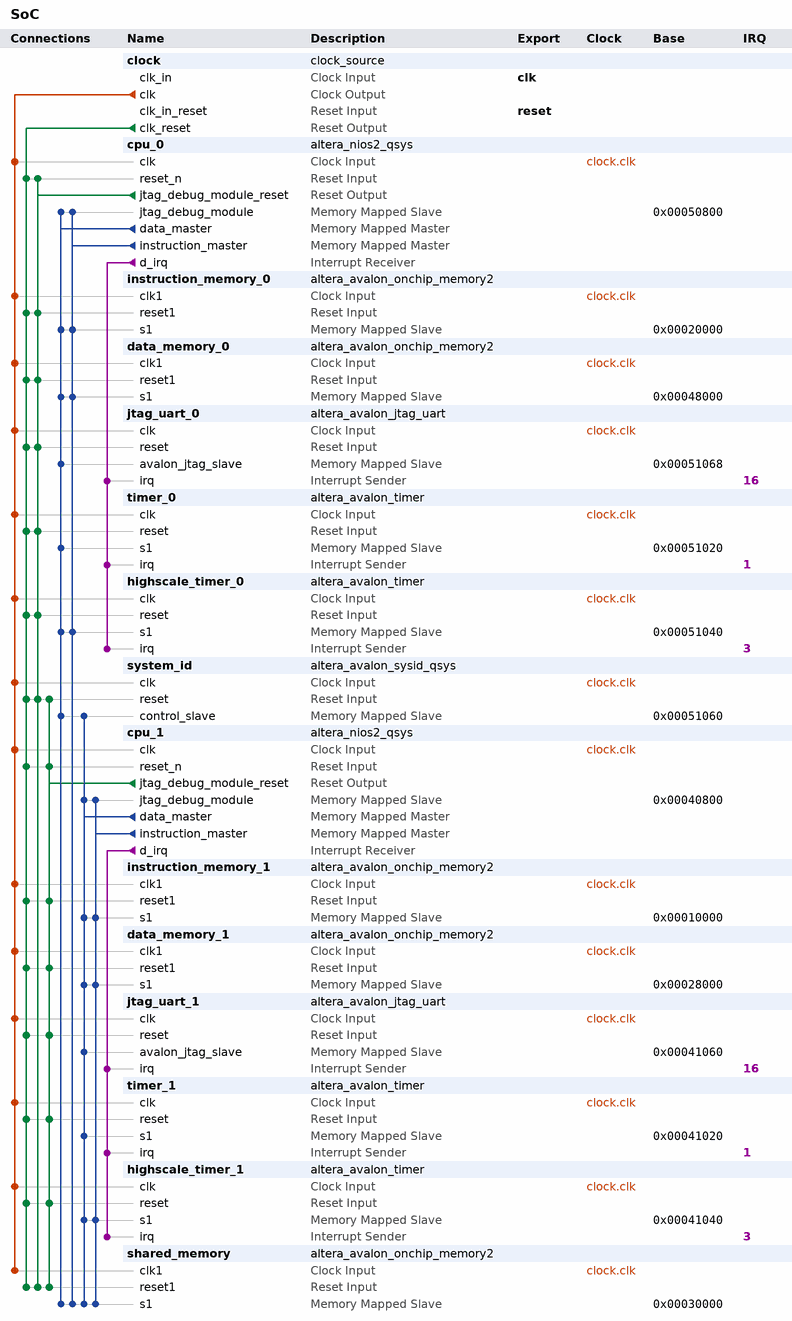
[diagram p0: system contents]
# Platform Designer (Qsys) system SoC, Cyclone IV E EP4CE115F29C7
# Parameters at their usual value, and those the tool derives, are not listed.
package require -exact qsys 13.1
create_system SoC
set_project_property DEVICE_FAMILY {Cyclone IV E}
set_project_property DEVICE EP4CE115F29C7

add_instance clock clock_source 13.1
set_instance_parameter_value clock clockFrequency 50000000

add_instance cpu_0 altera_nios2_qsys 13.1
set_instance_parameter_value cpu_0 resetSlave instruction_memory_0.s1
set_instance_parameter_value cpu_0 mmu_TLBMissExcSlave None
set_instance_parameter_value cpu_0 exceptionSlave instruction_memory_0.s1
set_instance_parameter_value cpu_0 breakSlave cpu_0.jtag_debug_module
set_instance_parameter_value cpu_0 muldiv_multiplierType NoneSmall
set_instance_parameter_value cpu_0 impl Small
set_instance_parameter_value cpu_0 icache_size 4096

add_instance instruction_memory_0 altera_avalon_onchip_memory2 13.1
set_instance_parameter_value instruction_memory_0 dataWidth 32
set_instance_parameter_value instruction_memory_0 dualPort false
set_instance_parameter_value instruction_memory_0 initMemContent true
set_instance_parameter_value instruction_memory_0 initializationFileName onchip_mem.hex
set_instance_parameter_value instruction_memory_0 memorySize 65536

add_instance data_memory_0 altera_avalon_onchip_memory2 13.1
set_instance_parameter_value data_memory_0 dataWidth 32
set_instance_parameter_value data_memory_0 dualPort false
set_instance_parameter_value data_memory_0 initMemContent true
set_instance_parameter_value data_memory_0 initializationFileName onchip_mem.hex
set_instance_parameter_value data_memory_0 memorySize 32768

add_instance jtag_uart_0 altera_avalon_jtag_uart 13.1
set_instance_parameter_value jtag_uart_0 simInteractiveOptions NO_INTERACTIVE_WINDOWS

add_instance timer_0 altera_avalon_timer 13.1
set_instance_parameter_value timer_0 period 1
set_instance_parameter_value timer_0 periodUnits MSEC

add_instance highscale_timer_0 altera_avalon_timer 13.1
set_instance_parameter_value highscale_timer_0 period 1
set_instance_parameter_value highscale_timer_0 periodUnits USEC

add_instance system_id altera_avalon_sysid_qsys 13.1
set_instance_parameter_value system_id id 0

add_instance cpu_1 altera_nios2_qsys 13.1
set_instance_parameter_value cpu_1 resetSlave instruction_memory_1.s1
set_instance_parameter_value cpu_1 mmu_TLBMissExcSlave None
set_instance_parameter_value cpu_1 exceptionSlave instruction_memory_1.s1
set_instance_parameter_value cpu_1 breakSlave cpu_1.jtag_debug_module
set_instance_parameter_value cpu_1 muldiv_multiplierType NoneSmall
set_instance_parameter_value cpu_1 impl Small
set_instance_parameter_value cpu_1 icache_size 4096

add_instance instruction_memory_1 altera_avalon_onchip_memory2 13.1
set_instance_parameter_value instruction_memory_1 dataWidth 32
set_instance_parameter_value instruction_memory_1 dualPort false
set_instance_parameter_value instruction_memory_1 initMemContent true
set_instance_parameter_value instruction_memory_1 initializationFileName onchip_mem.hex
set_instance_parameter_value instruction_memory_1 memorySize 65536

add_instance data_memory_1 altera_avalon_onchip_memory2 13.1
set_instance_parameter_value data_memory_1 dataWidth 32
set_instance_parameter_value data_memory_1 dualPort false
set_instance_parameter_value data_memory_1 initMemContent true
set_instance_parameter_value data_memory_1 initializationFileName onchip_mem.hex
set_instance_parameter_value data_memory_1 memorySize 32768

add_instance jtag_uart_1 altera_avalon_jtag_uart 13.1
set_instance_parameter_value jtag_uart_1 simInteractiveOptions NO_INTERACTIVE_WINDOWS

add_instance timer_1 altera_avalon_timer 13.1
set_instance_parameter_value timer_1 period 1
set_instance_parameter_value timer_1 periodUnits MSEC

add_instance highscale_timer_1 altera_avalon_timer 13.1
set_instance_parameter_value highscale_timer_1 period 1
set_instance_parameter_value highscale_timer_1 periodUnits USEC

add_instance shared_memory altera_avalon_onchip_memory2 13.1
set_instance_parameter_value shared_memory dataWidth 32
set_instance_parameter_value shared_memory dualPort false
set_instance_parameter_value shared_memory initMemContent true
set_instance_parameter_value shared_memory initializationFileName onchip_mem.hex
set_instance_parameter_value shared_memory memorySize 65536

# connections
add_connection clock.clk cpu_0.clk clock
add_connection clock.clk cpu_1.clk clock
add_connection clock.clk data_memory_0.clk1 clock
add_connection clock.clk data_memory_1.clk1 clock
add_connection clock.clk highscale_timer_0.clk clock
add_connection clock.clk highscale_timer_1.clk clock
add_connection clock.clk instruction_memory_0.clk1 clock
add_connection clock.clk instruction_memory_1.clk1 clock
add_connection clock.clk jtag_uart_0.clk clock
add_connection clock.clk jtag_uart_1.clk clock
add_connection clock.clk shared_memory.clk1 clock
add_connection clock.clk system_id.clk clock
add_connection clock.clk timer_0.clk clock
add_connection clock.clk timer_1.clk clock
add_connection clock.clk_reset cpu_0.reset_n reset
add_connection clock.clk_reset cpu_1.reset_n reset
add_connection clock.clk_reset data_memory_0.reset1 reset
add_connection clock.clk_reset data_memory_1.reset1 reset
add_connection clock.clk_reset highscale_timer_0.reset reset
add_connection clock.clk_reset highscale_timer_1.reset reset
add_connection clock.clk_reset instruction_memory_0.reset1 reset
add_connection clock.clk_reset instruction_memory_1.reset1 reset
add_connection clock.clk_reset jtag_uart_0.reset reset
add_connection clock.clk_reset jtag_uart_1.reset reset
add_connection clock.clk_reset shared_memory.reset1 reset
add_connection clock.clk_reset system_id.reset reset
add_connection clock.clk_reset timer_0.reset reset
add_connection clock.clk_reset timer_1.reset reset
add_connection cpu_0.jtag_debug_module_reset cpu_0.reset_n reset
add_connection cpu_0.jtag_debug_module_reset data_memory_0.reset1 reset
add_connection cpu_0.jtag_debug_module_reset highscale_timer_0.reset reset
add_connection cpu_0.jtag_debug_module_reset instruction_memory_0.reset1 reset
add_connection cpu_0.jtag_debug_module_reset jtag_uart_0.reset reset
add_connection cpu_0.jtag_debug_module_reset shared_memory.reset1 reset
add_connection cpu_0.jtag_debug_module_reset system_id.reset reset
add_connection cpu_0.jtag_debug_module_reset timer_0.reset reset
add_connection cpu_1.jtag_debug_module_reset cpu_1.reset_n reset
add_connection cpu_1.jtag_debug_module_reset data_memory_1.reset1 reset
add_connection cpu_1.jtag_debug_module_reset highscale_timer_1.reset reset
add_connection cpu_1.jtag_debug_module_reset instruction_memory_1.reset1 reset
add_connection cpu_1.jtag_debug_module_reset jtag_uart_1.reset reset
add_connection cpu_1.jtag_debug_module_reset shared_memory.reset1 reset
add_connection cpu_1.jtag_debug_module_reset system_id.reset reset
add_connection cpu_1.jtag_debug_module_reset timer_1.reset reset
add_connection cpu_0.data_master cpu_0.jtag_debug_module avalon
set_connection_parameter_value cpu_0.data_master/cpu_0.jtag_debug_module baseAddress 0x00050800
add_connection cpu_0.data_master data_memory_0.s1 avalon
set_connection_parameter_value cpu_0.data_master/data_memory_0.s1 baseAddress 0x00048000
add_connection cpu_0.data_master highscale_timer_0.s1 avalon
set_connection_parameter_value cpu_0.data_master/highscale_timer_0.s1 baseAddress 0x00051040
add_connection cpu_0.data_master instruction_memory_0.s1 avalon
set_connection_parameter_value cpu_0.data_master/instruction_memory_0.s1 baseAddress 0x00020000
add_connection cpu_0.data_master jtag_uart_0.avalon_jtag_slave avalon
set_connection_parameter_value cpu_0.data_master/jtag_uart_0.avalon_jtag_slave baseAddress 0x00051068
add_connection cpu_0.data_master shared_memory.s1 avalon
set_connection_parameter_value cpu_0.data_master/shared_memory.s1 baseAddress 0x00030000
add_connection cpu_0.data_master system_id.control_slave avalon
set_connection_parameter_value cpu_0.data_master/system_id.control_slave baseAddress 0x00051060
add_connection cpu_0.data_master timer_0.s1 avalon
set_connection_parameter_value cpu_0.data_master/timer_0.s1 baseAddress 0x00051020
add_connection cpu_0.instruction_master cpu_0.jtag_debug_module avalon
set_connection_parameter_value cpu_0.instruction_master/cpu_0.jtag_debug_module baseAddress 0x00050800
add_connection cpu_0.instruction_master data_memory_0.s1 avalon
set_connection_parameter_value cpu_0.instruction_master/data_memory_0.s1 baseAddress 0x00048000
add_connection cpu_0.instruction_master highscale_timer_0.s1 avalon
set_connection_parameter_value cpu_0.instruction_master/highscale_timer_0.s1 baseAddress 0x00051040
add_connection cpu_0.instruction_master instruction_memory_0.s1 avalon
set_connection_parameter_value cpu_0.instruction_master/instruction_memory_0.s1 baseAddress 0x00020000
add_connection cpu_0.instruction_master shared_memory.s1 avalon
set_connection_parameter_value cpu_0.instruction_master/shared_memory.s1 baseAddress 0x00030000
add_connection cpu_1.data_master cpu_1.jtag_debug_module avalon
set_connection_parameter_value cpu_1.data_master/cpu_1.jtag_debug_module baseAddress 0x00040800
add_connection cpu_1.data_master data_memory_1.s1 avalon
set_connection_parameter_value cpu_1.data_master/data_memory_1.s1 baseAddress 0x00028000
add_connection cpu_1.data_master highscale_timer_1.s1 avalon
set_connection_parameter_value cpu_1.data_master/highscale_timer_1.s1 baseAddress 0x00041040
add_connection cpu_1.data_master instruction_memory_1.s1 avalon
set_connection_parameter_value cpu_1.data_master/instruction_memory_1.s1 baseAddress 0x00010000
add_connection cpu_1.data_master jtag_uart_1.avalon_jtag_slave avalon
set_connection_parameter_value cpu_1.data_master/jtag_uart_1.avalon_jtag_slave baseAddress 0x00041060
add_connection cpu_1.data_master shared_memory.s1 avalon
set_connection_parameter_value cpu_1.data_master/shared_memory.s1 baseAddress 0x00030000
add_connection cpu_1.data_master system_id.control_slave avalon
set_connection_parameter_value cpu_1.data_master/system_id.control_slave baseAddress 0x00051060
add_connection cpu_1.data_master timer_1.s1 avalon
set_connection_parameter_value cpu_1.data_master/timer_1.s1 baseAddress 0x00041020
add_connection cpu_1.instruction_master cpu_1.jtag_debug_module avalon
set_connection_parameter_value cpu_1.instruction_master/cpu_1.jtag_debug_module baseAddress 0x00040800
add_connection cpu_1.instruction_master data_memory_1.s1 avalon
set_connection_parameter_value cpu_1.instruction_master/data_memory_1.s1 baseAddress 0x00028000
add_connection cpu_1.instruction_master highscale_timer_1.s1 avalon
set_connection_parameter_value cpu_1.instruction_master/highscale_timer_1.s1 baseAddress 0x00041040
add_connection cpu_1.instruction_master instruction_memory_1.s1 avalon
set_connection_parameter_value cpu_1.instruction_master/instruction_memory_1.s1 baseAddress 0x00010000
add_connection cpu_1.instruction_master shared_memory.s1 avalon
set_connection_parameter_value cpu_1.instruction_master/shared_memory.s1 baseAddress 0x00030000
add_connection cpu_0.d_irq highscale_timer_0.irq interrupt
set_connection_parameter_value cpu_0.d_irq/highscale_timer_0.irq irqNumber 3
add_connection cpu_0.d_irq jtag_uart_0.irq interrupt
set_connection_parameter_value cpu_0.d_irq/jtag_uart_0.irq irqNumber 16
add_connection cpu_0.d_irq timer_0.irq interrupt
set_connection_parameter_value cpu_0.d_irq/timer_0.irq irqNumber 1
add_connection cpu_1.d_irq highscale_timer_1.irq interrupt
set_connection_parameter_value cpu_1.d_irq/highscale_timer_1.irq irqNumber 3
add_connection cpu_1.d_irq jtag_uart_1.irq interrupt
set_connection_parameter_value cpu_1.d_irq/jtag_uart_1.irq irqNumber 16
add_connection cpu_1.d_irq timer_1.irq interrupt
set_connection_parameter_value cpu_1.d_irq/timer_1.irq irqNumber 1

# exported interfaces
add_interface clk clock sink
set_interface_property clk EXPORT_OF clock.clk_in
add_interface reset reset sink
set_interface_property reset EXPORT_OF clock.clk_in_reset

set_interconnect_requirement {$system} qsys_mm.clockCrossingAdapter HANDSHAKE
set_interconnect_requirement {$system} qsys_mm.maxAdditionalLatency 1
set_interconnect_requirement {$system} qsys_mm.insertDefaultSlave false

save_system SoC.qsys
